# EAGLE design adc_cap (EAGLE 7.0.0)
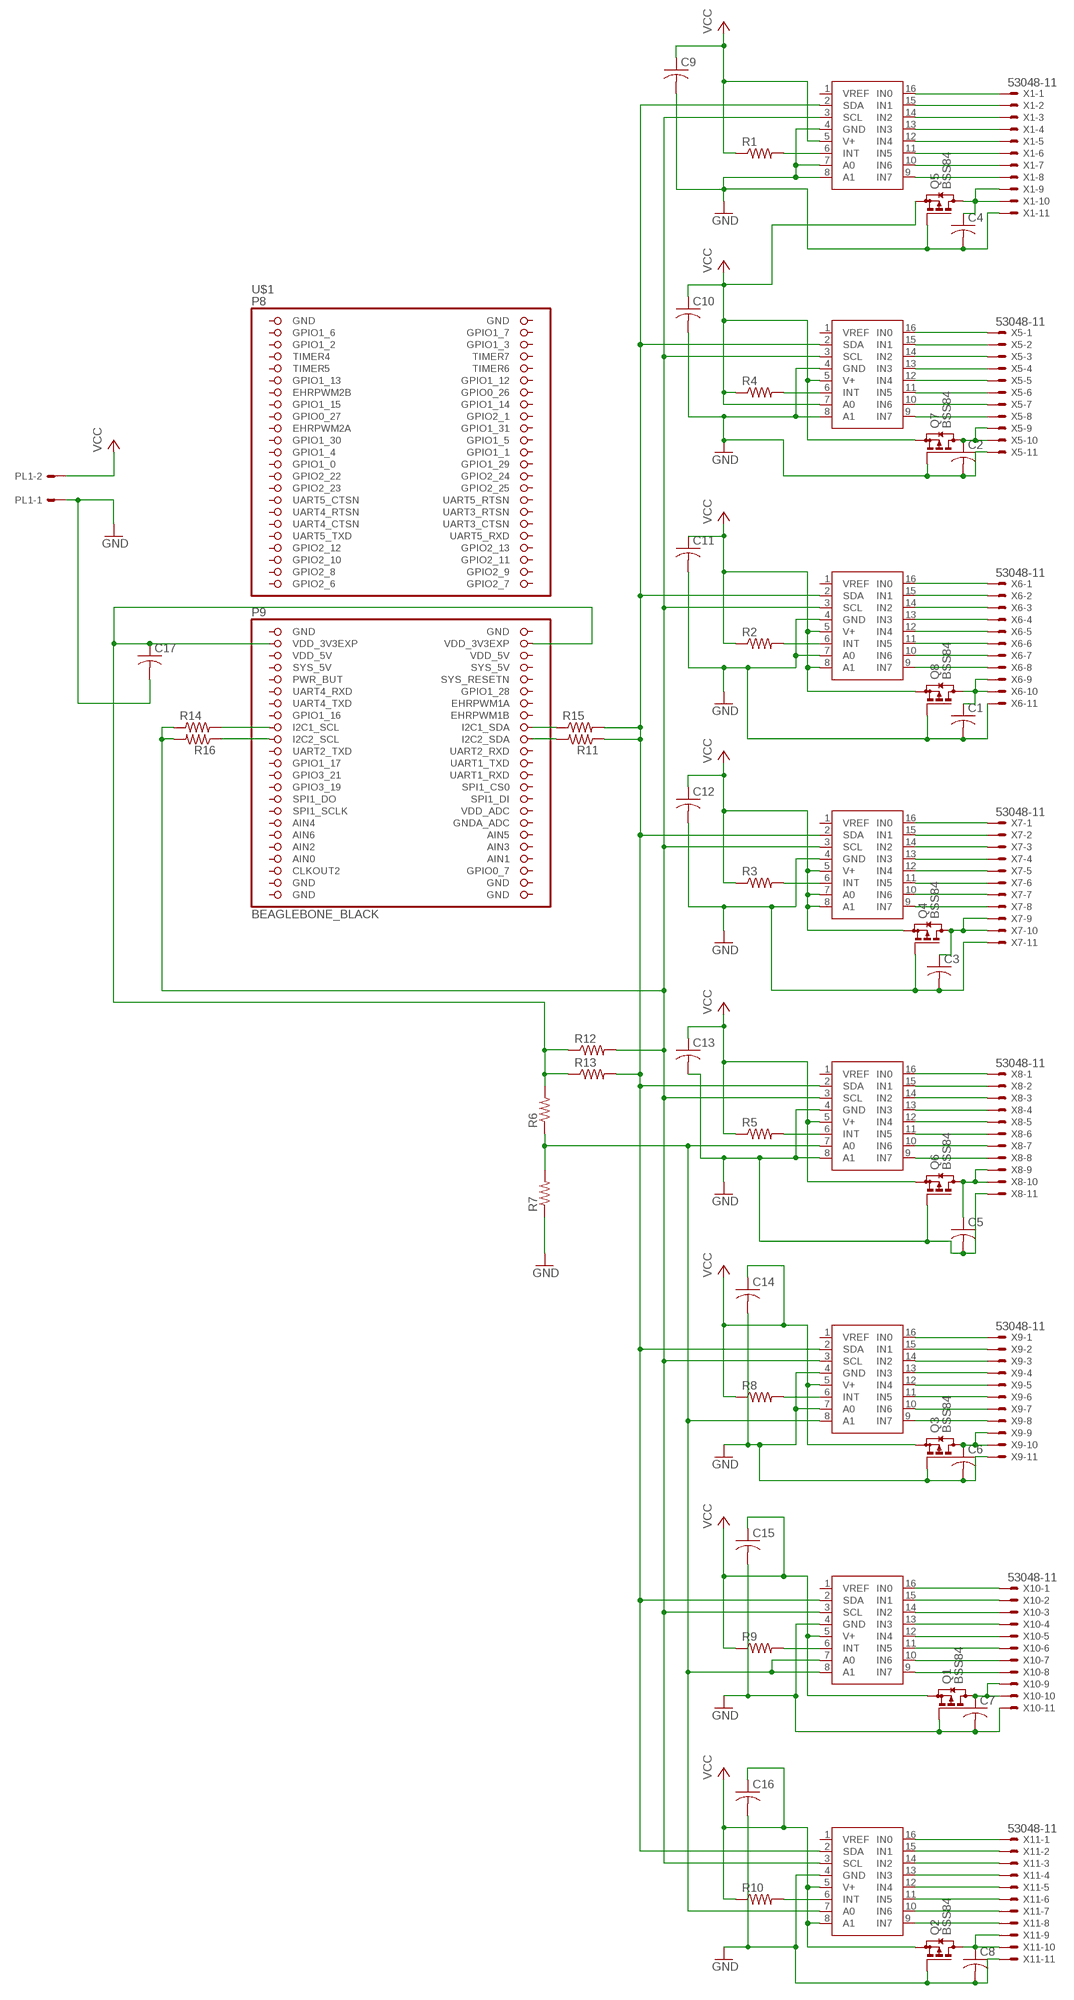
[diagram p0: schematic, sheet 1]

## Parts
C1  C-USC0805  [C0805]
C2  C-USC0805  [C0805]
C3  C-USC0805  [C0805]
C4  C-USC0805  [C0805]
C5  C-USC0805  [C0805]
C6  C-USC0805  [C0805]
C7  C-USC0805  [C0805]
C8  C-USC0805  [C0805]
C9  C-USC0805  [C0805]
C10  C-USC0805  [C0805]
C11  C-USC0805  [C0805]
C12  C-USC0805  [C0805]
C13  C-USC0805  [C0805]
C14  C-USC0805  [C0805]
C15  C-USC0805  [C0805]
C16  C-USC0805  [C0805]
C17  C-USC0805  [C0805]
PL1  555X-2H  [5569-2]
Q1  BSS84  [SOT23]
Q2  BSS84  [SOT23]
Q3  BSS84  [SOT23]
Q4  BSS84  [SOT23]
Q5  BSS84  [SOT23]
Q6  BSS84  [SOT23]
Q7  BSS84  [SOT23]
Q8  BSS84  [SOT23]
R1  R-US_R0805  [R0805]
R2  R-US_R0805  [R0805]
R3  R-US_R0805  [R0805]
R4  R-US_R0805  [R0805]
R5  R-US_R0805  [R0805]
R6  R-US_R0805  [R0805]
R7  R-US_R0805  [R0805]
R8  R-US_R0805  [R0805]
R9  R-US_R0805  [R0805]
R10  R-US_R0805  [R0805]
R11  R-US_R0805  [R0805]
R12  R-US_R0805  [R0805]
R13  R-US_R0805  [R0805]
R14  R-US_R0805  [R0805]
R15  R-US_R0805  [R0805]
R16  R-US_R0805  [R0805]
U$1  BEAGLEBONE_BLACK  [BEAGEBONE]
U$2  ADC128D818  [ADC12_SD]
U$3  ADC128D818  [ADC12_SD]
U$4  ADC128D818  [ADC12_SD]
U$5  ADC128D818  [ADC12_SD]
U$6  ADC128D818  [ADC12_SD]
U$7  ADC128D818  [ADC12_SD]
U$8  ADC128D818  [ADC12_SD]
U$9  ADC128D818  [ADC12_SD]
X1  53048-11  [53048-11]
X5  53048-11  [53048-11]
X6  53048-11  [53048-11]
X7  53048-11  [53048-11]
X8  53048-11  [53048-11]
X9  53048-11  [53048-11]
X10  53048-11  [53048-11]
X11  53048-11  [53048-11]

## Nets
GND: C1.2 C2.2 C3.2 C4.2 C5.2 C6.2 C7.2 C8.2 C9.2 C10.2 C11.2 C12.2 C13.2 C14.2 C15.2 C16.2 C17.2 PL1.1 Q1.1(G) Q2.1(G) Q3.1(G) Q4.1(G) Q5.1(G) Q6.1(G) Q7.1(G) Q8.1(G) R7.1 U$2.4(GND) U$2.8(A1) U$3.4(GND) U$3.7(A0) U$3.8(A1) U$4.4(GND) U$4.7(A0) U$5.4(GND) U$6.4(GND) U$6.8(A1) U$7.4(GND) U$7.7(A0) U$8.4(GND) U$9.4(GND) X1.11 X5.11 X6.11 X7.11 X8.11 X9.11 X10.11 X11.11
N$1: U$3.16(IN0) X1.1
N$2: U$3.15(IN1) X1.2
N$3: U$3.14(IN2) X1.3
N$4: U$3.13(IN3) X1.4
N$5: U$3.12(IN4) X1.5
N$6: U$3.11(IN5) X1.6
N$7: U$3.10(IN6) X1.7
N$8: U$3.9(IN7) X1.8
N$9: U$9.16(IN0) X11.1
N$10: U$9.15(IN1) X11.2
N$11: U$9.14(IN2) X11.3
N$12: U$9.13(IN3) X11.4
N$13: U$9.12(IN4) X11.5
N$14: U$9.11(IN5) X11.6
N$15: U$9.10(IN6) X11.7
N$16: U$9.9(IN7) X11.8
N$17: U$8.16(IN0) X10.1
N$18: U$8.15(IN1) X10.2
N$19: R4.2 U$2.6(INT)
N$20: U$8.14(IN2) X10.3
N$21: U$8.13(IN3) X10.4
N$22: U$8.12(IN4) X10.5
N$23: U$8.11(IN5) X10.6
N$24: U$8.10(IN6) X10.7
N$25: U$8.9(IN7) X10.8
N$26: R2.2 U$4.6(INT)
N$27: U$7.16(IN0) X9.1
N$28: U$7.15(IN1) X9.2
N$29: U$7.14(IN2) X9.3
N$30: U$7.13(IN3) X9.4
N$31: U$7.12(IN4) X9.5
N$32: U$7.11(IN5) X9.6
N$33: U$7.10(IN6) X9.7
N$34: U$7.9(IN7) X9.8
N$35: R3.2 U$5.6(INT)
N$36: U$6.16(IN0) X8.1
N$37: U$6.15(IN1) X8.2
N$38: U$6.14(IN2) X8.3
N$39: U$6.13(IN3) X8.4
N$40: U$6.12(IN4) X8.5
N$41: U$6.11(IN5) X8.6
N$42: U$6.10(IN6) X8.7
N$43: U$6.9(IN7) X8.8
N$44: R5.2 U$6.6(INT)
N$45: R6.1 R7.2 U$6.7(A0) U$7.8(A1) U$8.7(A0) U$8.8(A1) U$9.7(A0)
N$46: U$5.16(IN0) X7.1
N$47: U$5.15(IN1) X7.2
N$48: U$5.14(IN2) X7.3
N$49: U$5.13(IN3) X7.4
N$50: U$5.12(IN4) X7.5
N$51: U$5.11(IN5) X7.6
N$52: U$5.10(IN6) X7.7
N$53: U$5.9(IN7) X7.8
N$54: R8.2 U$7.6(INT)
N$55: R12.2 R14.1 R16.2 U$2.3(SCL) U$3.3(SCL) U$4.3(SCL) U$5.3(SCL) U$6.3(SCL) U$7.3(SCL) U$8.3(SCL) U$9.3(SCL)
N$56: U$4.16(IN0) X6.1
N$57: U$4.15(IN1) X6.2
N$58: U$4.14(IN2) X6.3
N$59: U$4.13(IN3) X6.4
N$60: U$4.12(IN4) X6.5
N$61: U$4.11(IN5) X6.6
N$62: U$4.10(IN6) X6.7
N$63: U$4.9(IN7) X6.8
N$64: R9.2 U$8.6(INT)
N$65: U$2.16(IN0) X5.1
N$66: U$2.15(IN1) X5.2
N$67: R1.2 U$3.6(INT)
N$68: U$2.14(IN2) X5.3
N$69: U$2.13(IN3) X5.4
N$70: U$2.12(IN4) X5.5
N$71: U$2.11(IN5) X5.6
N$72: U$2.10(IN6) X5.7
N$73: U$2.9(IN7) X5.8
N$74: R10.2 U$9.6(INT)
N$75: C4.1 Q5.3(D) X1.9 X1.10
N$76: C3.1 Q4.3(D) X7.9 X7.10
N$77: C1.1 Q8.3(D) X6.9 X6.10
N$78: C7.1 Q1.3(D) X10.9 X10.10
N$79: C2.1 Q7.3(D) X5.9 X5.10
N$80: R11.2 U$1.167(I2C2_SDA)
N$81: R15.1 U$1.165(I2C1_SDA)
N$82: C5.1 Q6.3(D) X8.9 X8.10
N$83: C8.1 Q2.3(D) X11.9 X11.10
N$84: R11.1 R13.2 R15.2 U$2.2(SDA) U$3.2(SDA) U$4.2(SDA) U$5.2(SDA) U$6.2(SDA) U$7.2(SDA) U$8.2(SDA) U$9.2(SDA)
N$85: R14.2 U$1.168(I2C1_SCL)
N$86: R16.1 U$1.166(I2C2_SCL)
N$87: C6.1 Q3.3(D) X9.9 X9.10
N$88: C17.1 R6.2 R12.1 R13.1 U$1.181(VDD_3V3EXP) U$1.182(VDD_3V3EXP)
VCC: C9.1 C10.1 C11.1 C12.1 C13.1 C14.1 C15.1 C16.1 PL1.2 Q1.2(S) Q2.2(S) Q3.2(S) Q4.2(S) Q5.2(S) Q6.2(S) Q7.2(S) Q8.2(S) R1.1 R2.1 R3.1 R4.1 R5.1 R8.1 R9.1 R10.1 U$2.5(V+) U$2.7(A0) U$3.5(V+) U$4.5(V+) U$4.8(A1) U$5.5(V+) U$5.7(A0) U$5.8(A1) U$6.5(V+) U$7.5(V+) U$8.5(V+) U$9.5(V+) U$9.8(A1)
Unconnected: U$1.93(GPIO2_7) U$1.94(GPIO2_6) U$1.95(GPIO2_9) U$1.96(GPIO2_8) U$1.97(GPIO2_11) U$1.98(GPIO2_10) U$1.99(GPIO2_13) U$1.100(GPIO2_12) U$1.101(UART5_RXD) U$1.102(UART5_TXD) U$1.103(UART3_CTSN) U$1.104(UART4_CTSN) U$1.105(UART3_RTSN) U$1.106(UART4_RTSN) U$1.107(UART5_RTSN) U$1.108(UART5_CTSN) U$1.109(GPIO2_25) U$1.110(GPIO2_23) U$1.111(GPIO2_24) U$1.112(GPIO2_22) U$1.113(GPIO1_29) U$1.114(GPIO1_0) U$1.115(GPIO1_1) U$1.116(GPIO1_4) U$1.117(GPIO1_5) U$1.118(GPIO1_30) U$1.119(GPIO1_31) U$1.120(EHRPWM2A) U$1.121(GPIO2_1) U$1.122(GPIO0_27) U$1.123(GPIO1_14) U$1.124(GPIO1_15) U$1.125(GPIO0_26) U$1.126(EHRPWM2B) U$1.127(GPIO1_12) U$1.128(GPIO1_13) U$1.129(TIMER6) U$1.130(TIMER5) U$1.131(TIMER7) U$1.132(TIMER4) U$1.133(GPIO1_3) U$1.134(GPIO1_2) U$1.135(GPIO1_7) U$1.136(GPIO1_6) U$1.143(GPIO0_7) U$1.144(CLKOUT2) U$1.145(AIN1) U$1.147(AIN3) U$1.148(AIN2) U$1.149(AIN5) U$1.150(AIN6) U$1.151(GNDA_ADC) U$1.152(AIN4) U$1.153(VDD_ADC) U$1.154(SPI1_SCLK) U$1.155(SPI1_DI) U$1.156(SPI1_DO) U$1.157(SPI1_CS0) U$1.158(GPIO3_19) U$1.159(UART1_RXD) U$1.160(GPIO3_21) U$1.161(UART1_TXD) U$1.162(GPIO1_17) U$1.163(UART2_RXD) U$1.164(UART2_TXD) U$1.169(EHRPWM1B) U$1.170(GPIO1_16) U$1.171(EHRPWM1A) U$1.172(UART4_TXD) U$1.173(GPIO1_28) U$1.174(UART4_RXD) U$1.175(SYS_RESETN) U$1.176(PWR_BUT) U$1.177(SYS_5V) U$2.1(VREF) U$3.1(VREF) U$4.1(VREF) U$5.1(VREF) U$6.1(VREF) U$7.1(VREF) U$8.1(VREF) U$9.1(VREF)

## Power pins joined to a net without a drawn wire
AIN0: U$1.146(AIN0)
GND: U$1.137(GND) U$1.138(GND) U$1.139(GND) U$1.140(GND) U$1.141(GND) U$1.142(GND) U$1.183(GND) U$1.184(GND)
SYS_5V: U$1.178(SYS_5V)
VDD_5V: U$1.179(VDD_5V) U$1.180(VDD_5V)

## Library data of the parts
C1-C17 = rcl:C-US: CAPACITOR, American symbol
PL1 = con-molex-2:555X-2: Mini FIT connector 2 way
Q1-Q8 = transistor-small-signal:BSS84: P-CHANNEL MOS FET
R1-R10 R12 R13 = adafruit:R-US_: RESISTOR, American symbol
R11 R14-R16 = rcl:R-US_: RESISTOR, American symbol
U$1 = BeagleBone:BEAGLEBONE_BLACK
U$2-U$9 = ADC128D818:ADC128D818
X1 X5-X11 = con-molex:53?-11: CONNECTOR wire to board 1.25 mm (.049 inch) pitch header; MPN: 53048-1110; OC_FARNELL: unknown; OC_NEWARK: 28M9451

## Net classes
0 default: width 2.54 mm, drill 0.508 mm, clearance 0.254 mm

## Board
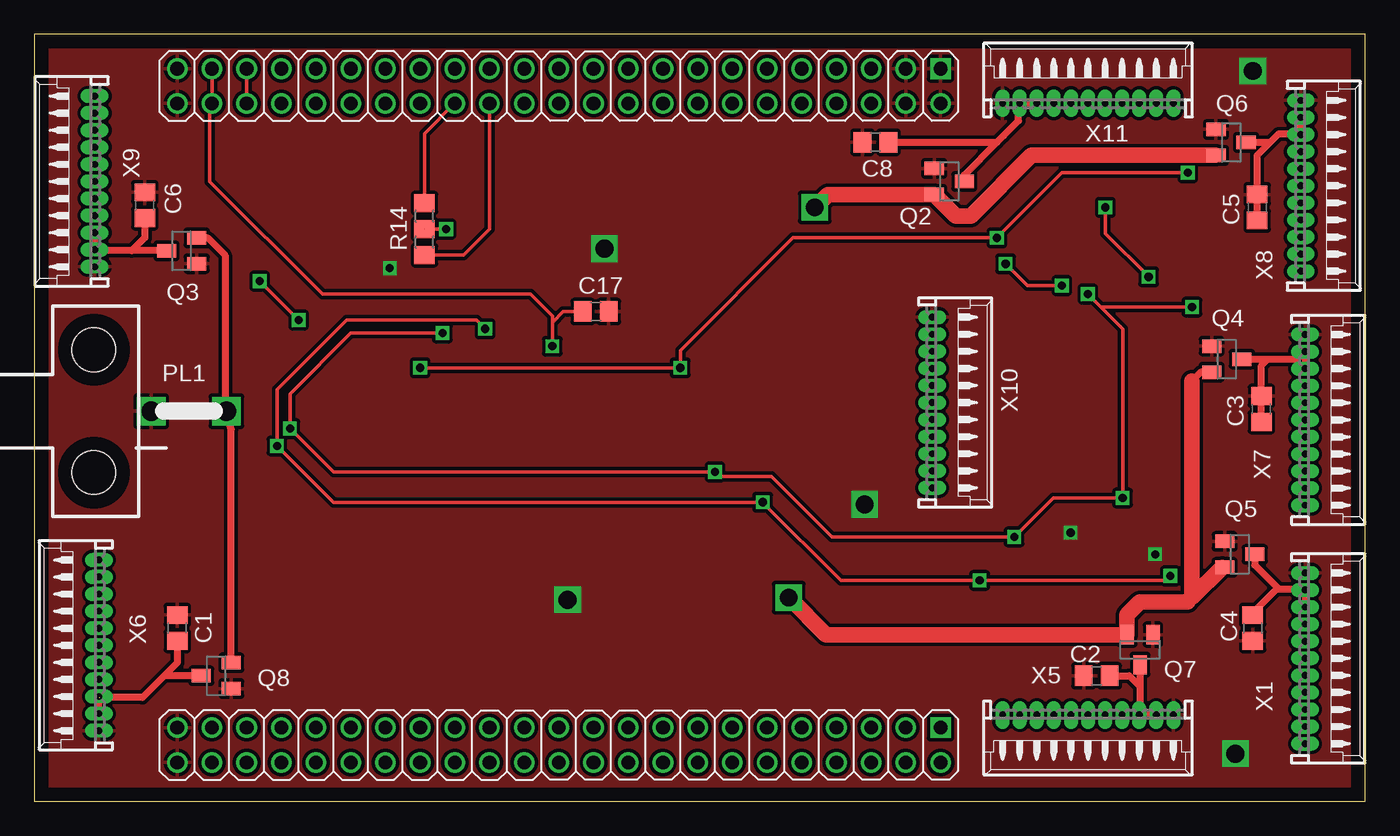
[diagram p1: board, top side]
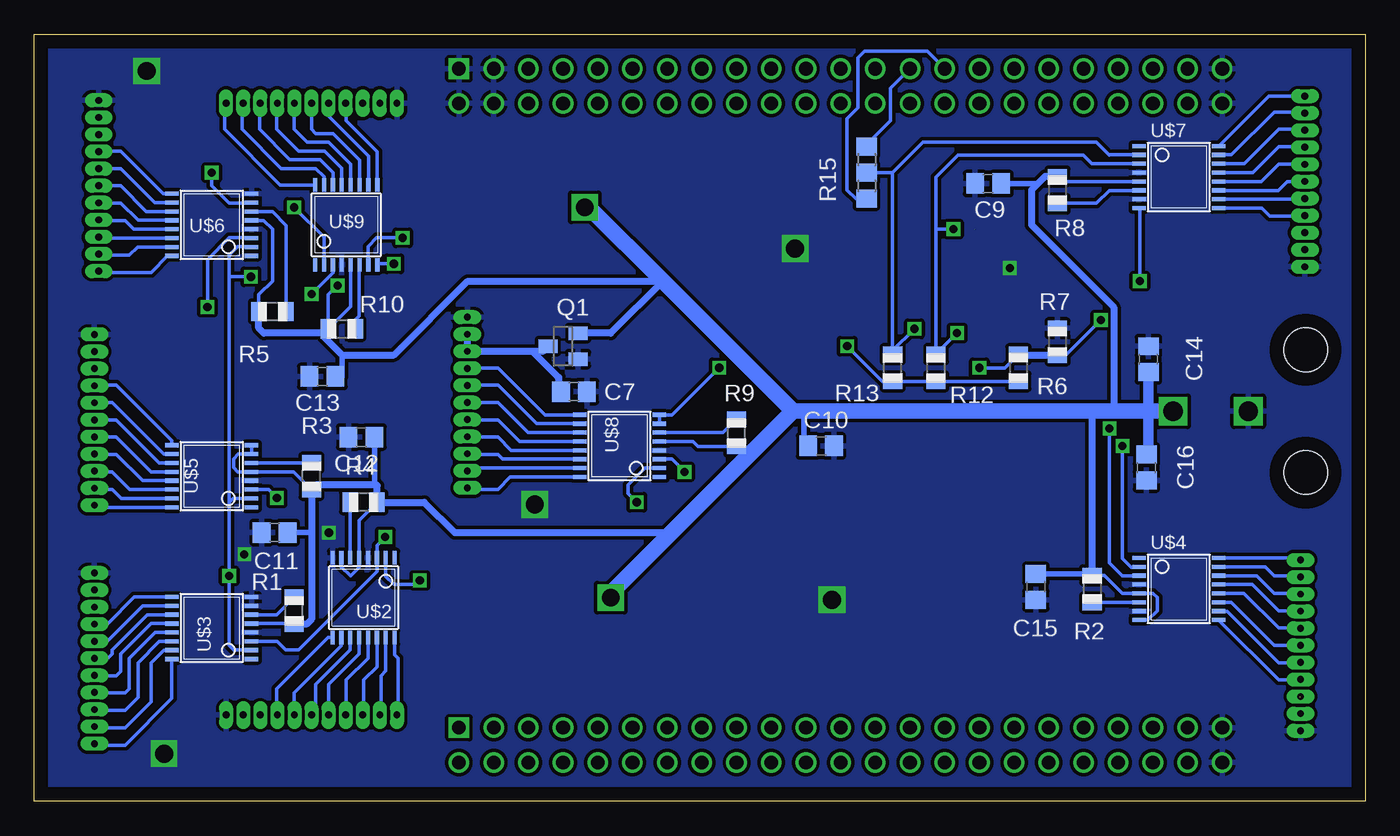
[diagram p2: board, bottom side, seen from below]

Size 97.46 x 56.19 mm. Coordinates in mm from the lower left corner, seen from the top.
Outline: 0,0 97.46,0 97.46,56.19 0,56.19 0,0
Copper layers (1*16): Top 0.035mm / dielectric 1.5mm / Bottom 0.035mm
Design rules "default": minimum track width 10mil, minimum drill 24mil, track to track 8mil, track to pad 8mil, pad to pad 8mil, via to via 8mil, smd to smd 8mil, copper to edge 40mil, drill to drill 8mil, minimum pad ring 10mil, minimum via ring 8mil, stop-mask expansion 4mil, vias tented up to drill 0mil, thermal gap 10mil

### Footprints (pad centres in the part's own frame; a part is rotated, then mirrored left to right if it is on the bottom)
C0805 = smd 1.3 x 1.5: 1 -0.95,0; 2 0.95,0
5569-2 = drill 1.4 square: 1 0,0; 2 0,5.5 | hole 3.2: 4.5,-4.2; -4.5,-4.2
SOT23 = smd 1 x 1.4: 1 -0.95,-1.1; 2 0.95,-1.1; 3 0,1.1
R0805 = smd 1.1 x 1.4: 1 -1,0; 2 1,0
R0805' = smd 1.3 x 1.5: 1 -0.95,0; 2 0.95,0
BEAGEBONE = drill 1 square: 93 -22.225,-33.02; 139 26.035,-33.02 | drill 1: 94 -24.765,-33.02; 95 -22.225,-30.48; 96 -24.765,-30.48; 97 -22.225,-27.94; 98 -24.765,-27.94; 99 -22.225,-25.4; 100 -24.765,-25.4; 101 -22.225,-22.86; 102 -24.765,-22.86; 103 -22.225,-20.32; 104 -24.765,-20.32; 105 -22.225,-17.78; 106 -24.765,-17.78; 107 -22.225,-15.24; 108 -24.765,-15.24; 109 -22.225,-12.7; 110 -24.765,-12.7; 111 -22.225,-10.16; 112 -24.765,-10.16; 113 -22.225,-7.62; 114 -24.765,-7.62; 115 -22.225,-5.08; 116 -24.765,-5.08; 117 -22.225,-2.54; 118 -24.765,-2.54; 119 -22.225,0; 120 -24.765,0; 121 -22.225,2.54; 122 -24.765,2.54; 123 -22.225,5.08; 124 -24.765,5.08; 125 -22.225,7.62; 126 -24.765,7.62; 127 -22.225,10.16; 128 -24.765,10.16; 129 -22.225,12.7; 130 -24.765,12.7; 131 -22.225,15.24; 132 -24.765,15.24; 133 -22.225,17.78; 134 -24.765,17.78; 135 -22.225,20.32; 136 -24.765,20.32; 137 -22.225,22.86; 138 -24.765,22.86; 140 23.495,-33.02; 141 26.035,-30.48; 142 23.495,-30.48; 143 26.035,-27.94; 144 23.495,-27.94; 145 26.035,-25.4; 146 23.495,-25.4; 147 26.035,-22.86; 148 23.495,-22.86; 149 26.035,-20.32; 150 23.495,-20.32; 151 26.035,-17.78; 152 23.495,-17.78; 153 26.035,-15.24; 154 23.495,-15.24; 155 26.035,-12.7; 156 23.495,-12.7; 157 26.035,-10.16; 158 23.495,-10.16; 159 26.035,-7.62; 160 23.495,-7.62; 161 26.035,-5.08; 162 23.495,-5.08; 163 26.035,-2.54; 164 23.495,-2.54; 165 26.035,0; 166 23.495,0; 167 26.035,2.54; 168 23.495,2.54; 169 26.035,5.08; 170 23.495,5.08; 171 26.035,7.62; 172 23.495,7.62; 173 26.035,10.16; 174 23.495,10.16; 175 26.035,12.7; 176 23.495,12.7; 177 26.035,15.24; 178 23.495,15.24; 179 26.035,17.78; 180 23.495,17.78; 181 26.035,20.32; 182 23.495,20.32; 183 26.035,22.86; 184 23.495,22.86
ADC12_SD = smd 0.305 x 0.991: 1 -2.275,-2.918; 2 -1.625,-2.918; 3 -0.975,-2.918; 4 -0.325,-2.918; 5 0.325,-2.918; 6 0.975,-2.918; 7 1.625,-2.918; 8 2.275,-2.918; 9 2.275,2.918; 10 1.625,2.918; 11 0.975,2.918; 12 0.325,2.918; 13 -0.325,2.918; 14 -0.975,2.918; 15 -1.625,2.918; 16 -2.275,2.918
53048-11 = drill 0.5 pad 0.698 long: 1 6.25,-1.25; 2 5,-1.25; 3 3.75,-1.25; 4 2.5,-1.25; 5 1.25,-1.25; 6 0,-1.25; 7 -1.25,-1.25; 8 -2.5,-1.25; 9 -3.75,-1.25; 10 -5,-1.25; 11 -6.25,-1.25

### Placement (x,y rotation side)
C1  10.48,12.7 90 top
C2  77.79,9.21 180 top
C3  89.85,28.73 90 top
C4  89.22,12.7 270 top
C5  89.53,43.5 90 top
C6  8.1,43.66 90 top
C7  57.94,30 0 bottom
C8  61.59,48.26 180 top
C9  27.62,45.24 180 bottom
C10  39.85,26.04 0 bottom
C11  79.85,19.68 180 bottom
C12  73.5,26.67 180 bottom
C13  76.36,31.11 180 bottom
C14  15.88,32.38 90 bottom
C15  24.13,15.72 270 bottom
C16  16.03,24.45 270 bottom
C17  41.12,35.88 0 top
PL1  8.57,28.57 270 top
Q1  58.74,33.34 90 bottom
Q2  66.99,45.4 270 top
Q3  10.79,40.32 90 top
Q4  87.31,32.38 270 top
Q5  88.27,18.1 270 top
Q6  87.63,48.26 270 top
Q7  80.96,11.11 180 top
Q8  13.34,9.21 90 top
R1  78.42,13.97 90 bottom
R2  20,15.56 270 bottom
R3  77.15,23.81 90 bottom
R4  73.34,21.91 180 bottom
R5  80.01,35.88 0 bottom
R6  25.4,31.75 270 bottom
R7  22.54,33.66 270 bottom
R8  22.54,44.77 270 bottom
R9  46.04,26.99 90 bottom
R10  74.93,34.61 0 bottom
R11  [R0805']  36.51,45.09 270 bottom
R12  31.43,31.75 90 bottom
R13  34.61,31.75 90 bottom
R14  [R0805']  28.57,42.86 90 top
R15  [R0805']  36.51,46.99 270 bottom
R16  [R0805']  28.57,40.96 90 top
U$1  33.34,27.62 90 top
U$2  73.34,14.92 180 bottom
U$3  84.45,12.7 90 bottom
U$4  13.65,15.56 270 bottom
U$5  84.45,23.81 90 bottom
U$6  84.45,42.23 90 bottom
U$7  13.65,45.72 270 bottom
U$8  54.61,26.04 90 bottom
U$9  74.61,42.23 0 bottom
X1  94.3,10.48 270 top
X5  77.15,5.08 180 top
X6  3.49,11.43 90 top
X7  94.3,27.94 270 top
X8  93.98,45.09 270 top
X9  3.17,45.4 90 top
X10  66.99,29.21 270 top
X11  77.15,52.39 0 top

### Tracks (layer width: path | path; a pad name or v marks a point on that pad's centre or on a via)
GND  (via drill 0.6, 1.3)
  other vias: 60.8,21.75 75.88,19.68 82.07,18.1 26.04,39.05 39.05,14.76 41.75,40.48 87.95,3.49 89.22,53.5
  pour Bottom (isolate 0.254): -1.59,-0.64 97.79,-0.64 97.79,58.42 -1.59,58.42
  pour Top (isolate 0.254): 0,-0.64 97.47,0.32 97.47,55.24 0,55.24
N$1
  Bottom 0.254: U$3.16 87.37,7.56 90.81,4.13 92.95,4.13 X1.1
N$2
  Bottom 0.254: U$3.15 87.98,11.08 88.9,10.16 88.9,7.3 90.81,5.4 92.97,5.4 X1.2
N$3
  Bottom 0.254: U$3.14 88.29,11.72 89.85,10.16 89.85,7.62 90.81,6.67 92.99,6.67 X1.3
N$4
  Bottom 0.254: U$3.13 88.59,12.37 90.49,10.48 90.49,8.26 90.81,7.94 93.01,7.94 X1.4
N$5
  Bottom 0.254: U$3.12 88.89,13.03 91.12,10.79 91.12,9.53 91.44,9.21 93.03,9.21 X1.5
N$6
  Bottom 0.254: U$3.11 89.19,13.68 91.76,11.11 91.76,10.79 92.08,10.48 X1.6
N$7
  Bottom 0.254: U$3.10 89.5,14.33 92.08,11.75 93.03,11.75 X1.7
N$8
  Bottom 0.254: U$3.9 90.12,14.97 92.08,13.02 93.01,13.02 X1.8
N$9
  Bottom 0.254: X11.1 83.5,51.04 83.5,49.21 79.44,45.15 U$9.16
N$10
  Bottom 0.254: U$9.15 76.24,45.76 76.83,46.35 79.38,46.35 82.23,49.21 82.23,51.06 X11.2
N$11
  Bottom 0.254: U$9.14 75.59,46.06 76.52,46.99 78.74,46.99 80.96,49.21 80.96,51.08 X11.3
N$12
  Bottom 0.254: U$9.13 74.94,46.36 76.2,47.63 78.11,47.63 79.69,49.21 79.69,51.1 X11.4
N$13
  Bottom 0.254: U$9.12 74.29,46.67 75.88,48.26 77.47,48.26 78.42,49.21 78.42,51.12 X11.5
N$14
  Bottom 0.254: U$9.11 73.64,46.97 75.56,48.89 76.83,48.89 77.15,49.21 X11.6
N$15
  Bottom 0.254: U$9.10 72.99,47.27 75.88,50.17 75.88,51.12 X11.7
N$16
  Bottom 0.254: U$9.9 72.34,47.57 74.61,49.85 74.61,51.1 X11.8
N$17
  Bottom 0.254: U$8.16 62.6,23.76 63.5,22.86 65.64,22.86 X10.1
N$18
  Bottom 0.254: U$8.15 65.54,24.41 X10.2
N$19
  Bottom 0.254: R4.2 74.32,21.88 U$2.6
N$20
  Bottom 0.254: U$8.14 63.16,25.06 63.5,25.4 65.68,25.4 X10.3
N$21
  Bottom 0.254: U$8.13 62.54,25.71 63.5,26.67 65.7,26.67 X10.4
N$22
  Bottom 0.254: U$8.12 61.92,26.36 63.5,27.94 65.72,27.94 X10.5
N$23
  Bottom 0.254: U$8.11 61.3,27.01 63.5,29.21 X10.6
N$24
  Bottom 0.254: U$8.10 60.68,27.66 63.5,30.48 65.72,30.48 X10.7
N$25
  Bottom 0.254: U$8.9 60.06,28.31 63.5,31.75 65.7,31.75 X10.8
N$26
  Bottom 0.254: R2.2 16.59,14.56 U$4.6
N$27
  Bottom 0.254: X9.1 7.08,51.65 U$7.16
N$28
  Bottom 0.254: U$7.15 9.8,47.35 6.67,50.48 4.5,50.48 X9.2
N$29
  Bottom 0.254: U$7.14 8.87,46.7 6.35,49.21 4.49,49.21 X9.3
N$30
  Bottom 0.254: U$7.13 8.25,46.05 6.35,47.94 4.46,47.94 X9.4
N$31
  Bottom 0.254: U$7.12 7.63,45.39 6.35,46.67 4.45,46.67 X9.5
N$32
  Bottom 0.254: U$7.11 6.37,44.74 5.71,45.4 X9.6
N$33
  Bottom 0.254: U$7.10 4.48,44.1 X9.7
N$34
  Bottom 0.254: U$7.9 7.57,43.45 6.99,42.86 4.46,42.86 X9.8
N$35
  Bottom 0.254: R3.2 77.18,24.79 U$5.6
N$36
  Bottom 0.254: U$6.16 87.68,39.95 88.9,38.74 92.63,38.74 X8.1
N$37
  Bottom 0.254: U$6.15 89.89,40.6 90.49,40 92.65,40 X8.2
N$38
  Bottom 0.254: U$6.14 92.65,41.25 X8.3
N$39
  Bottom 0.254: U$6.13 90.16,41.9 90.81,42.55 92.69,42.55 X8.4
N$40
  Bottom 0.254: U$6.12 89.86,42.55 91.12,43.81 92.71,43.81 X8.5
N$41
  Bottom 0.254: U$6.11 89.24,43.2 91.12,45.09 X8.6
N$42
  Bottom 0.254: U$6.10 88.62,43.85 91.12,46.35 92.71,46.35 X8.7
N$43
  Bottom 0.254: U$6.9 88,44.5 91.12,47.63 92.69,47.63 X8.8
N$44
  Bottom 0.254: R5.2 79.01,42.18 80.01,43.18 81.52,43.18 U$6.6
N$45  (via drill 0.6)
  Top 0.254: v28.26,31.75 v47.31,31.75 47.31,33.02 55.56,41.28 v70.48,41.28 75.25,46.04 v84.45,46.04 | v19.37,35.24 v16.51,38.1
  Bottom 0.254: U$8.7 U$8.8 50.75,28.31 v47.31,31.75 | R6.1 26.4,31.75 v28.26,31.75 | U$9.7 73.03,39.35 73.03,40.64 72.39,41.28 v70.48,41.28 71.12,41.28 | U$6.7 81.5,43.81 83.19,43.81 84.45,45.09 v84.45,46.04 | R7.2 21.95,32.65 v19.37,35.24 | v16.51,38.1 16.51,43.38 U$7.8
  Bottom 0.508: R7.2 25.3,32.65 R6.1
N$46
  Bottom 0.254: U$5.16 92.89,21.54 X7.1
N$47
  Bottom 0.254: U$5.15 91.08,22.19 91.76,22.86 92.97,22.86 X7.2
N$48
  Bottom 0.254: U$5.14 90.47,22.84 91.76,24.13 92.99,24.13 X7.3
N$49
  Bottom 0.254: U$5.13 89.53,23.49 91.44,25.4 93.01,25.4 X7.4
N$50
  Bottom 0.254: U$5.12 88.91,24.14 91.44,26.67 93.03,26.67 X7.5
N$51
  Bottom 0.254: U$5.11 88.29,24.79 91.44,27.94 X7.6
N$52
  Bottom 0.254: U$5.10 87.98,25.44 91.76,29.21 93.03,29.21 X7.7
N$53
  Bottom 0.254: U$5.9 87.37,26.41 91.44,30.48 93.01,30.48 X7.8
N$54
  Bottom 0.254: R8.2 22.5,43.81 19.68,43.81 18.75,44.74 U$7.6
N$55  (via drill 0.6)  (1 unrouted)
  Top 0.254: v29.89,34.29 23.18,34.29 18.73,29.85 v18.73,27.31 21.91,24.13 v49.85,24.13 50.16,23.81 53.98,23.81 58.42,19.37 v71.75,19.37 74.61,22.22 v79.69,22.22 79.69,34.61 v77.15,37.15 78.11,36.2 v84.77,36.2 | R14.1 v30.16,41.91
  Bottom 0.254: 31.43,41.91 R12.2 v29.89,34.29 | 31.43,41.91 31.43,45.72 29.84,47.31 20.64,47.31 20.02,46.7 U$7.3 | U$4.3 16.59,16.51 17.78,16.51 18.73,17.46 v18.73,27.31 | U$8.3 50.78,25.06 v49.85,24.13 | v71.75,19.37 72.37,18.76 U$2.3 72.37,16.85 78.11,11.11 79.06,11.11 79.67,11.72 U$3.3 | U$5.3 80.31,22.84 v79.69,22.22 | U$9.3 75.56,39.29 75.56,38.74 v77.15,37.15 | v84.77,36.2 84.77,39.69 83.19,41.28 81.56,41.28 U$6.3 | v30.16,41.91 31.43,41.91
N$56
  Bottom 0.254: U$4.16 4.74,17.83 X6.1
N$57
  Bottom 0.254: U$4.15 7.34,17.18 6.67,16.51 4.82,16.51 X6.2
N$58
  Bottom 0.254: U$4.14 7.96,16.53 6.67,15.24 4.8,15.24 X6.3
N$59
  Bottom 0.254: U$4.13 8.26,15.88 6.35,13.97 4.78,13.97 X6.4
N$60
  Bottom 0.254: U$4.12 8.88,15.23 6.35,12.7 4.76,12.7 X6.5
N$61
  Bottom 0.254: U$4.11 9.82,14.58 6.67,11.43 X6.6
N$62
  Bottom 0.254: U$4.10 10.12,13.93 6.35,10.16 4.76,10.16 X6.7
N$63
  Bottom 0.254: U$4.9 10.73,13.27 6.35,8.89 4.78,8.89 X6.8
N$64
  Bottom 0.254: R9.2 47.02,27.01 U$8.6
N$65
  Bottom 0.254: U$2.16 71.07,10.74 70.8,10.48 70.8,6.43 X5.1
N$66
  Bottom 0.254: U$2.15 71.72,9.56 72.07,9.21 72.07,6.41 X5.2
N$67
  Bottom 0.254: R1.2 79.72,13.68 U$3.6
N$68
  Bottom 0.254: U$2.14 72.37,9.86 73.34,8.89 73.34,6.39 X5.3
N$69
  Bottom 0.254: U$2.13 73.02,10.49 74.61,8.89 74.61,6.37 X5.4
N$70
  Bottom 0.254: U$2.12 73.67,10.79 75.88,8.57 75.88,6.35 X5.5
N$71
  Bottom 0.254: U$2.11 74.32,11.09 76.83,8.57 76.83,6.65 X5.6
N$72
  Bottom 0.254: U$2.10 74.97,11.39 78.42,7.94 78.42,6.35 X5.7
N$73
  Bottom 0.254: U$2.9 75.94,12 79.69,8.26 79.69,6.37 X5.8
N$74
  Bottom 0.254: U$9.6 73.66,39.29 73.66,35.56 73.93,35.29 R10.2
N$75
  Top 0.508: Q5.3 89.36,17.31 91.04,15.64 | 91.04,15.64 91.12,15.56 92.97,15.56 X1.10 X1.9 | C4.1 89.22,13.81 91.04,15.64
N$76
  Top 0.508: Q4.3 90.33,32.38 | 90.33,32.38 92.49,32.38 X7.10 X7.9 | C3.1 89.85,31.91 90.33,32.38
N$77  (1 unrouted)
  Top 0.508: Q8.3 9.53,9.21 | 9.53,9.21 7.94,7.62 4.8,7.62 X6.9 | X6.10 4.74,6.65 4.76,7.62 | C1.1 10.48,10.16 9.53,9.21
N$78
  Bottom 0.508: Q1.3 60.22,32.96 60.96,32.96 | 60.96,32.96 X10.9 X10.10 | C7.1 59.05,31.05 60.96,32.96
N$79
  Top 0.508: Q7.3 80.96,8.41 | 80.96,8.41 80.96,6.39 X5.9 X5.10 | C2.1 80.17,9.21 80.96,8.41
N$80
  Bottom 0.254: R11.2 37.31,44.13 37.94,44.77 37.94,50.01 37.15,50.8 37.15,54.45 36.67,54.93 32.07,54.93 U$1.167
N$81
  Bottom 0.254: R15.1 36.51,48.1 34.77,49.85 34.77,52.23 U$1.165
N$82
  Top 0.508: Q6.3 90.49,48.26 | 90.49,48.26 90.65,48.42 91.12,48.89 92.67,48.89 X8.9 X8.10 | C5.1 89.53,47.31 90.49,48.26
N$83
  Top 0.508: Q2.3 68.09,45.87 70.48,48.26 | X11.9 X11.10 72.07,51.06 72.07,49.85 70.96,48.74 70.48,48.26 | C8.1 70.48,48.26
N$84  (via drill 0.6)
  Top 0.254: v33.02,34.61 32.38,35.24 22.86,35.24 17.78,30.16 v17.78,26.04 21.91,21.91 v53.34,21.91 59.05,16.19 v69.22,16.19 82.87,16.19 v83.19,16.51 | v78.42,43.5 78.42,41.59 v81.6,38.42
  Bottom 0.254: 34.61,46.04 R13.2 34.61,33.02 v33.02,34.61 | 34.61,46.04 32.38,48.26 19.68,48.26 18.73,47.31 18.7,47.35 U$7.2 | U$4.2 16.61,17.14 17.14,17.14 17.78,17.78 v17.78,26.04 | U$8.2 52.74,24.41 53.98,23.18 53.98,22.54 v53.34,21.91 | U$2.2 71.72,16.47 71.12,15.87 69.53,15.87 v69.22,16.19 | U$3.2 81.58,11.11 82.87,11.11 83.19,11.43 v83.19,16.51 83.19,21.91 | U$5.2 82.91,22.19 83.19,21.91 | 83.19,21.91 83.19,38.42 | 83.19,38.42 83.19,40 82.55,40.64 81.58,40.64 U$6.2 | U$9.2 76.24,41.31 v78.42,43.5 | v81.6,38.42 83.19,38.42 | 34.61,46.04 R15.2
N$85
  Top 0.254: R14.2 28.57,48.89 U$1.168
N$86
  Top 0.254: R16.1 31.43,40.01 33.34,41.91 U$1.166
N$87
  Top 0.508: Q3.3 7.14,40.32 | 7.14,40.32 4.5,40.32 X9.10 X9.9 | C6.1 8.1,41.28 7.14,40.32
N$88  (via drill 0.6)
  Top 0.254: v37.94,33.34 37.94,35.08 | 37.94,35.08 37.94,35.56 36.35,37.15 21.11,37.15 12.86,45.4 12.86,50.96 U$1.182 U$1.181 | C17.1 38.73,35.88 37.94,35.08
  Bottom 0.254: R13.1 R12.1 R6.2 35.35,30.75 v37.94,33.34
VCC  (via drill 0.6, 1.3)
  Top 0.254: v71.12,39.37 72.71,37.78 v75.25,37.78
  Top 0.508: Q5.2 87,17.15 | Q7.2 | Q4.2 85.41,31.44 84.77,30.8 | 84.77,14.92 84.45,14.61 | Q8.2 14.44,27.26 PL1.2 13.97,29.42 13.97,40 12.7,41.27 Q3.2
  Top 1.143: v57.15,43.5 58.1,44.45 Q2.2 67.48,42.86 68.58,42.86 73.03,47.31 Q6.2 | Q7.2 57.95,12.21 v55.24,14.92 | 87,17.15 84.77,14.92 84.77,30.8 | 84.45,14.61 80.96,14.61 80.01,13.65 Q7.2
  Bottom 0.254: R9.1 48.85,25.99 49.21,26.35 U$8.5 | R5.1 81.01,37.1 80.01,38.1 80.01,41.91 80.64,42.55 81.53,42.55 U$6.5 | R2.1 19.1,16.56 17.78,15.24 U$4.5 15.55,15.23 15.24,14.92 15.24,13.97 15.93,13.28 U$4.8 | R8.1 22.17,45.39 U$7.5 | R3.1 78.48,24.14 U$5.5 82.56,24.14 82.87,24.45 82.87,25.08 82.51,25.44 U$5.7 U$5.8 | U$9.5 74.29,36.25 R10.1 75.93,37.1 v75.25,37.78 | U$9.8 72.28,39.37 v71.12,39.37 | R4.1 73.67,20.58 U$2.5 73.67,17.14 74.3,16.51 74.97,17.18 U$2.7 | R1.1 78.48,13.03 U$3.5
  Bottom 0.406: C12.1 72.55,23.18 | C11.1 77.15,19.69 | C15.1 20,16.67 R2.1 | C9.1 24.05,45.24 24.05,45.16 | C10.1 41.12,26.04 41.12,28.58 | C13.1 74.93,31.11 74.93,32.7
  Bottom 0.508: 44.77,25.72 45.77,25.72 R9.1 | R2.1 20,28.58 | R8.1 23.45,45.77 24.05,45.16 24.45,44.77 24.45,42.23 18.41,36.2 18.41,28.89 18.1,28.58 | 50.8,19.69 66.67,19.69 68.9,21.91 R4.1 72.34,23.13 72.39,23.18 72.55,23.18 76.79,23.18 R3.1 77.15,19.69 77.15,13.34 77.52,12.97 R1.1 | R10.1 76.25,34.29 | 76.25,34.29 80.64,34.29 81.01,34.66 R5.1 | 76.25,34.29 76.25,34.02 74.93,32.7 71.12,32.7 65.72,38.1 51.44,38.1 55.25,34.29 Q1.2 | v55.24,14.92 55.24,15.24
  Bottom 0.762: C16.1 15.88,25.4 15.88,28.58 C14.1
  Bottom 1.143: PL1.2 15.88,28.58 18.1,28.58 20,28.58 41.12,28.58 41.91,28.58 | 41.91,28.58 44.77,25.72 50.8,19.69 55.24,15.24 | 41.91,28.58 51.44,38.1 56.83,43.5 v57.15,43.5
VDD_5V
  Top 0.254: U$1.180 U$1.179